# Altium schematic sheet MCU.SchDoc
size A4; SheetNumber: 5; SheetTotal: 5
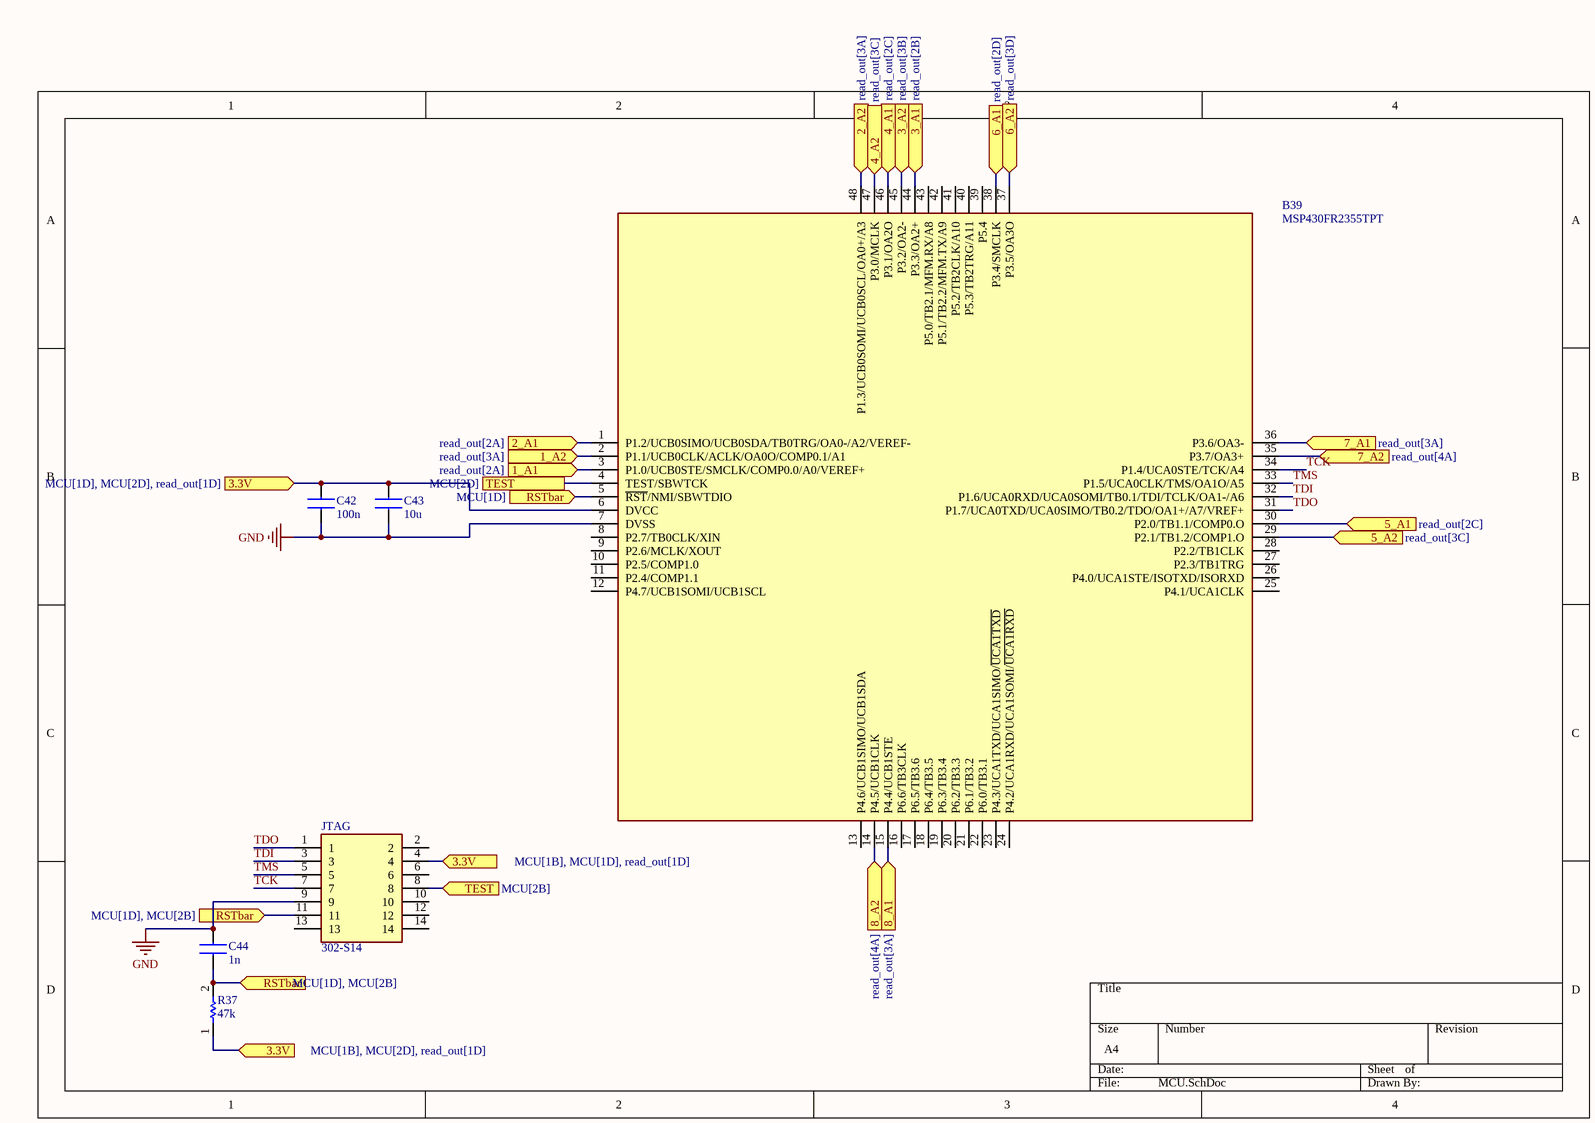
[diagram p0: MCU.SchDoc]

## Parts
B39  MSP430FR2355TPT  [QFP50P900X900X160-48N]
C42  100n  [0805X7R106KT1AT]
C43  10u  [0805X7R106KT1AT]
C44  1n  [0805X7R106KT1AT]
JTAG  302-S14  [CONN_7024614xx_MOL]
R37  47k  [CR0805-FX-1543ELF]

## Ports
1_A1 (in, see read_out[2A]), 1_A2 (in, see read_out[3A]), 2_A1 (in, see read_out[2A]), 2_A2 (in, see read_out[3A]), 3.3V (in, see MCU[1B], MCU[1D], read_out[1D]), 3.3V (in, see MCU[1B], MCU[2D], read_out[1D]), 3.3V (in, see MCU[1D], MCU[2D], read_out[1D]), 3_A1 (in, see read_out[2B]), 3_A2 (in, see read_out[3B]), 4_A1 (in, see read_out[2C]), 4_A2 (in, see read_out[3C]), 5_A1 (in, see read_out[2C]), 5_A2 (in, see read_out[3C]), 6_A1 (in, see read_out[2D]), 6_A2 (in, see read_out[3D]), 7_A1 (in, see read_out[3A]), 7_A2 (in, see read_out[4A]), 8_A1 (in, see read_out[3A]), 8_A2 (in, see read_out[4A]), RSTbar (in, see MCU[1D]), RSTbar (in, see MCU[1D], MCU[2B]), TEST (in, see MCU[2B]), TEST (see MCU[2D])

## Nets
GND: B39.7(DVSS) C42.2 C43.2 C44.2 JTAG.9
1_A1: B39.3(P1.0/UCB0STE/SMCLK/COMP0.0/A0/VEREF+) ; port 1_A1
1_A2: B39.2(P1.1/UCB0CLK/ACLK/OA0O/COMP0.1/A1) ; port 1_A2
2_A1: B39.1(P1.2/UCB0SIMO/UCB0SDA/TB0TRG/OA0-/A2/VEREF-) ; port 2_A1
2_A2: B39.48(P1.3/UCB0SOMI/UCB0SCL/OA0+/A3) ; port 2_A2
3.3V: B39.6(DVCC) C42.1 C43.1 JTAG.4 R37.1 ; port 3.3V
3_A1: B39.44(P3.3/OA2+) ; port 3_A1
3_A2: B39.45(P3.2/OA2-) ; port 3_A2
4_A1: B39.46(P3.1/OA2O) ; port 4_A1
4_A2: B39.47(P3.0/MCLK) ; port 4_A2
5_A1: B39.30(P2.0/TB1.1/COMP0.O) ; port 5_A1
5_A2: B39.29(P2.1/TB1.2/COMP1.O) ; port 5_A2
6_A1: B39.38(P3.4/SMCLK) ; port 6_A1
6_A2: B39.37(P3.5/OA3O) ; port 6_A2
7_A1: B39.36(P3.6/OA3-) ; port 7_A1
7_A2: B39.35(P3.7/OA3+) ; port 7_A2
8_A1: B39.15(P4.4/UCB1STE) ; port 8_A1
8_A2: B39.14(P4.5/UCB1CLK) ; port 8_A2
RSTbar: B39.5(~{RST}/NMI/SBWTDIO) C44.1 JTAG.11 R37.2 ; port RSTbar
TCK: B39.34(P1.4/UCA0STE/TCK/A4) JTAG.7
TDI: B39.32(P1.6/UCA0RXD/UCA0SOMI/TB0.1/TDI/TCLK/OA1-/A6) JTAG.3
TDO: B39.31(P1.7/UCA0TXD/UCA0SIMO/TB0.2/TDO/OA1+/A7/VREF+) JTAG.1
TEST: B39.4(TEST/SBWTCK) JTAG.8 ; port TEST
TMS: B39.33(P1.5/UCA0CLK/TMS/OA1O/A5) JTAG.5

Not connected (* = marked no-connect by the designer): B39 8(P2.7/TB0CLK/XIN) 9(P2.6/MCLK/XOUT) 10(P2.5/COMP1.0) 11(P2.4/COMP1.1) 12(P4.7/UCB1SOMI/UCB1SCL) 13(P4.6/UCB1SIMO/UCB1SDA) 16(P6.6/TB3CLK) 17(P6.5/TB3.6) 18(P6.4/TB3.5) 19(P6.3/TB3.4) 20(P6.2/TB3.3) 21(P6.1/TB3.2) 22(P6.0/TB3.1) 23(P4.3/UCA1TXD/UCA1SIMO/~{UCA1TXD}) 24(P4.2/UCA1RXD/UCA1SOMI/~{UCA1RXD}) 25(P4.1/UCA1CLK) 26(P4.0/UCA1STE/ISOTXD/ISORXD) 27(P2.3/TB1TRG) 28(P2.2/TB1CLK) 39(P5.4) 40(P5.3/TB2TRG/A11) 41(P5.2/TB2CLK/A10) 42(P5.1/TB2.2/MFM.TX/A9) 43(P5.0/TB2.1/MFM.RX/A8); JTAG 2 6 10 12 13 14

## Library data of the parts
B39 = MSP430FR2355TPT: 16-bit Microcontrollers - MCU 24MHz 105C ULP Microcontroller With 32 KB FRAM, 4 KB SRAM, 44 IO, 12-bit ADC, 12-bit DACs, OpAmp/PGA 48-LQFP -40 to 105; Manufacturer_Name: Texas Instruments; Geometry.Height: 1.6mm; Mouser Part Number: 595-MSP430FR2355TPT; Mouser Price/Stock: https://www.mouser.co.uk/ProductDetail/Texas-Instruments/MSP430FR2355TPT?qs=gTYE2QTfZfTjQOKK%2F%2Fw59A%3D%3D; Manufacturer_Part_Number: MSP430FR2355TPT; Datasheet Link: https://datasheet.datasheetarchive.com/originals/distributors/DKDS41/DSANUWW0029426.pdf
C42-C44 = capacitor
JTAG = JTAG
R37 = resistor